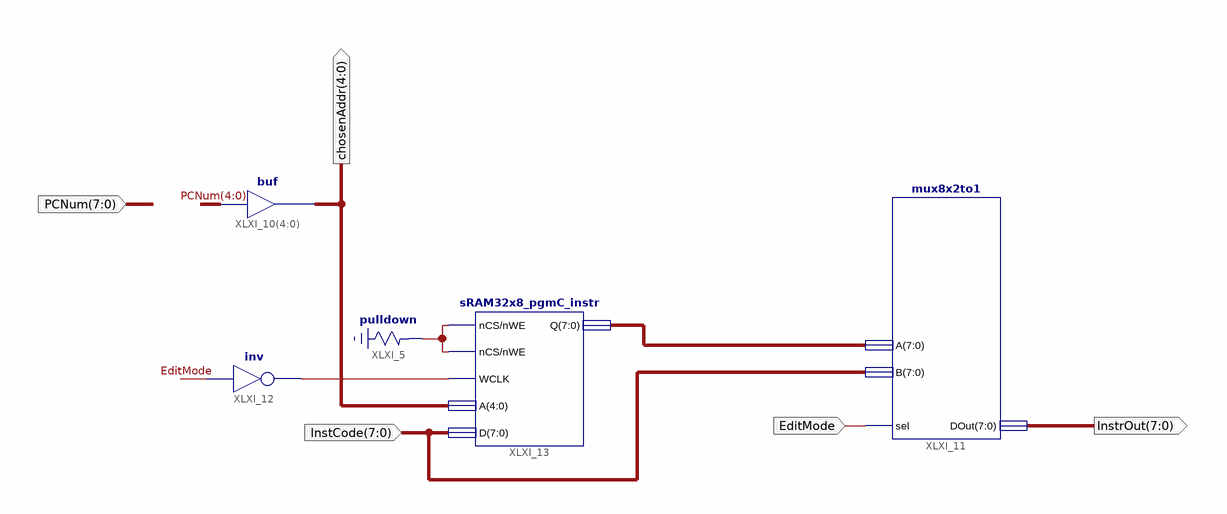
[diagram p0: schematic sheet 1]
// Xilinx ISE schematic InstructionMem.sch (spartan3e) as structural Verilog: 5 symbols, 5 ports
module InstructionMem (
  input  [7:0] InstCode,
  input  [7:0] PCNum,
  input  EditMode,
  output [4:0] chosenAddr,
  output [7:0] InstrOut
);

  wire WriteClk, XLXN_2;
  wire [7:0] AddrContent;

  \pulldown  XLXI_5 (.O(XLXN_2));
  assign chosenAddr = PCNum[4:0];  // buf XLXI_10[4..0], 5 bits wide
  mux8x2to1 XLXI_11 (.A(AddrContent), .B(InstCode), .sel(EditMode), .DOut(InstrOut));
  not XLXI_12 (WriteClk, EditMode);
  sRAM32x8_pgmC_instr XLXI_13 (
    .nCS(XLXN_2), .nWE(XLXN_2), .WCLK(WriteClk), .A(chosenAddr), .D(InstCode), .Q(AddrContent));
endmodule
